# Altium schematic sheet LCD_SD.SchDoc
size A3; Address1: Address1; Address2: Address2; Address3: Address3; Address4: Address4
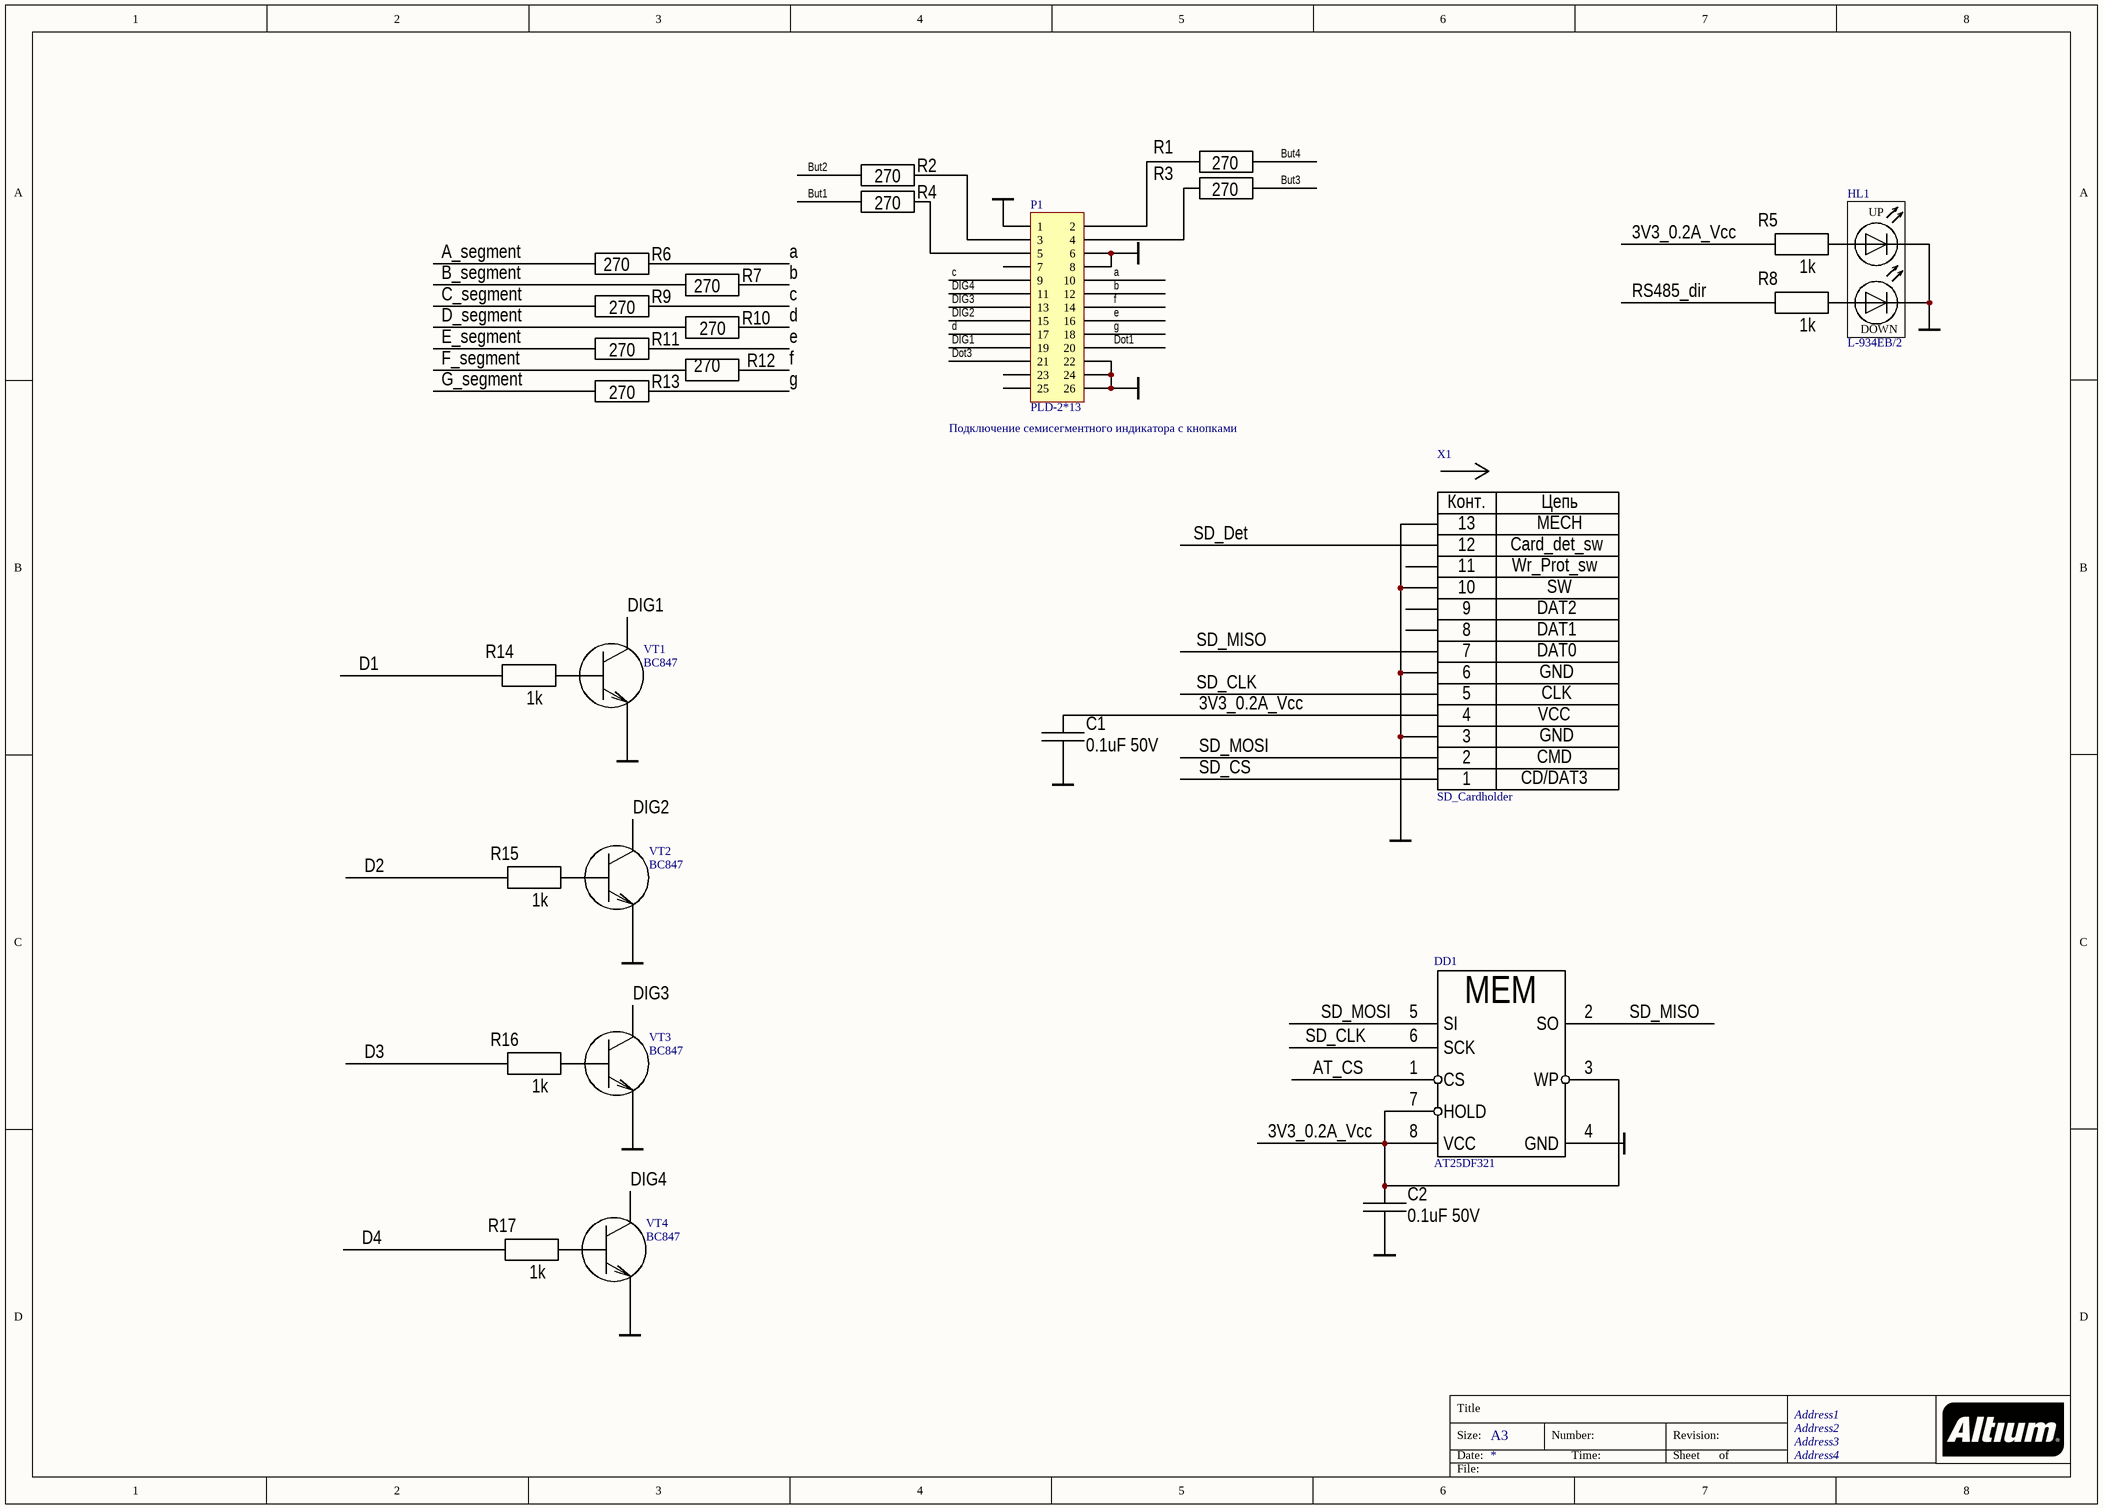
[diagram p0: LCD_SD.SchDoc]

## Parts
C1  0.1uF 50V  [0805_CAP]
C2  0.1uF 50V  [0805_CAP]
DD1  AT25DF321  [soic8-200]
HL1  L-934EB/2  [L-934EB/2]
P1  PLD-2*13  Destiny: Подключение семисегментного индикатора с кнопками  [HDR2X13]
R1  270  [0805_RES]
R2  270  [0805_RES]
R3  270  [0805_RES]
R4  270  [0805_RES]
R5  1k  [0805_RES]
R6  270  [0805_RES]
R7  270  [0805_RES]
R8  1k  [0805_RES]
R9  270  [0805_RES]
R10  270  [0805_RES]
R11  270  [0805_RES]
R12  270  [0805_RES]
R13  270  [0805_RES]
R14  1k  [0805_RES]
R15  1k  [0805_RES]
R16  1k  [0805_RES]
R17  1k  [0805_RES]
VT1  BC847  [sot23-3]
VT2  BC847  [sot23-3]
VT3  BC847  [sot23-3]
VT4  BC847  [sot23-3]
X1  SD_Cardholder  [SDcardHolder]

## Nets
GND: C1.2 C2.2 DD1.4(GND) HL1.1 HL1.3 P1.1 P1.6 P1.8 P1.22 P1.24 P1.26 VT1.2(E) VT2.2(E) VT3.2(E) VT4.2(E) X1.3 X1.6 X1.10 X1.13
3V3_0.2A_Vcc: C1.1 C2.1 DD1.3(WP) DD1.7(HOLD) DD1.8(VCC) R5.2 X1.4
a: P1.10 R6.1
A_segment: R6.2
AT_CS: DD1.1(CS)
b: P1.12 R7.1
B_segment: R7.2
But1: R4.2
But2: R2.2
But3: R3.2
But4: R1.2
c: P1.9 R9.1
C_segment: R9.2
d: P1.17 R10.1
D1: R14.2
D2: R15.2
D3: R16.2
D4: R17.2
D_segment: R10.2
DIG1: P1.19 VT1.3(C)
DIG2: P1.15 VT2.3(C)
DIG3: P1.13 VT3.3(C)
DIG4: P1.11 VT4.3(C)
Dot1: P1.20
Dot3: P1.21
e: P1.16 R11.1
E_segment: R11.2
f: P1.14 R12.1
F_segment: R12.2
g: P1.18 R13.1
G_segment: R13.2
RS485_dir: R8.2
SD_CLK: DD1.6(SCK) X1.5
SD_CS: X1.1
SD_Det: X1.12
SD_MISO: DD1.2(SO) X1.7
SD_MOSI: DD1.5(SI) X1.2
NetHL1_2: HL1.2 R8.1
NetHL1_4: HL1.4 R5.1
NetP1_2: P1.2 R1.1
NetP1_3: P1.3 R2.1
NetP1_4: P1.4 R3.1
NetP1_5: P1.5 R4.1
NetR14_1: R14.1 VT1.1(B)
NetR15_1: R15.1 VT2.1(B)
NetR16_1: R16.1 VT3.1(B)
NetR17_1: R17.1 VT4.1(B)

Not connected (* = marked no-connect by the designer): P1 7 23 25; X1 8 9 11

## Notes on the sheet
- Title
- Size:
- Date:
- A3
- Number:
- Time:
- Revision:
- Sheet
- of
- File:
- (in symbol AT25DF321) MEM
- (in symbol LEDx2) UP; DOWN
- (in symbol SD_Cardholder) Конт.; Цепь; MECH; Card_det_sw; Wr_Prot_sw; SW; DAT2; DAT1; DAT0; GND; CLK; VCC; CMD; CD/DAT3

## Library data of the parts
C1 C2 = Cap_np: Value: 0.1uF 50V
HL1 = LEDx2: Value: L-934EB/2
P1 = Header 13X2: Header, 13-Pin, Dual row; Value: PLD-2*13
R1-R17 = Res
  R1-R4 R6 R7 R9-R13: Value: 270
  R5 R8 R14-R17: Value: 1k
VT1-VT4 = transistor_npn: Value: BC847
DD1 = AT25DF321: Value: AT25DF321
X1 = SD_Cardholder: Value: SD_Cardholder